# Altium schematic sheet CLK_GEN.SchDoc: Clock generator
size 420 x 297 mm; CheckedBy: P.Kulik; Author: G.Kasprowicz; CompanyName: WUT ISE; DrawnBy: G.Kasprowicz; Organization: WUT ISE; Address1: PW ISE; Address2: Nowowiejska 15/19 00-665 Warsaw; Address3: gkasprow@gmail.com; Revision: 2; SheetNumber: -; SheetTotal: -; ModifiedBy: -; CheckedDate: -; DivGrp: WUT ISE; Designer: G.Kasprowicz; ModifiedDate: -; ProjectName: Sensor Box
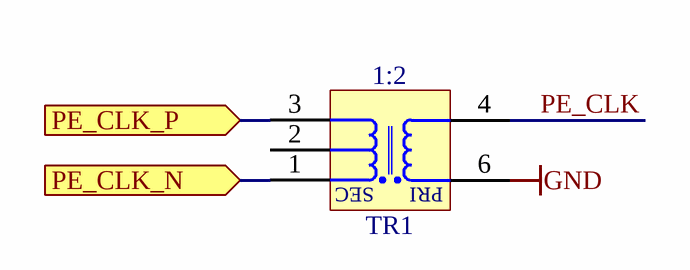
[diagram p0: CLK_GEN.SchDoc]

## Parts
TR1  1:2  [XFMR_MINI-CIRCUITS_DB714]

## Ports
PE_CLK_N (in), PE_CLK_P (in)

## Nets
GND: TR1.6(PDOT)
PE_CLK: TR1.4(P)
PE_CLK_N: TR1.1(SDOT) ; port PE_CLK_N
PE_CLK_P: TR1.3(S) ; port PE_CLK_P

Not connected (* = marked no-connect by the designer): TR1 2(NU)

## Notes on the sheet
- Project/Equipment
- Document
- Designer
- Drawn by
- Check.by
- Contact
- File
- Last Mod.
- Print Date
- Sheet
- Size
- A3
- of
- Rev
- Copyright WUT 2021.
  This document describes Open Hardware and is licensed under the CERN-OHL-W v2
  You may redistribute and modify this documentation and make products using it under the terms of the CERN-OHL-W v2 (https:/cern.ch/cern-ohl). This documentation is distributed WITHOUT ANY EXPRESS OR IMPLIED WARRANTY, INCLUDING OF MERCHANTABILITY, SATISFACTORY QUALITY AND FITNESS FOR A PARTICULAR PURPOSE. Please see the CERN-OHL-W v2 for applicable conditions.
  As per CERN-OHL-W v2 section 4, should You produce hardware based
  on these sources, You must maintain the Source Location visible on the
  silkscreen or top copper for a  product you make using this documentation..
- (in symbol XFMR_MINI-CIRCUITS_TCM2-1T) SEC; PRI

## Library data of the parts
TR1 = XFMR_MINI-CIRCUITS_TCM2-1T: 50 Ohms 3 to 300MHz RF Transformer; Power: 0.25W; Part Number: XFMR_MINI-CIRCUITS_TCM2-1T; Component Kind: Standard; Component Type: Standard; Pin Count: 6; Value: 1:2; Status: None; Part Description: 50 Ohms 3 to 300MHz RF Transformer; Manufacturer: MINI-CIRCUITS; Manufacturer Part Number: TCM2-1T; Mounted: Yes; Socket: No; Sense: No; SMD: Yes; ComponentHeight: 4.06mm; HelpURL: \\cern.ch\dfs\Applications\Altium\Datasheets\XFMR_MINI-CIRCUITS_TCM2-1T.pdf; Author: CERN DEM HF; CreateDate: 30.05.2023; LatestRevisionDate: 30.05.2023